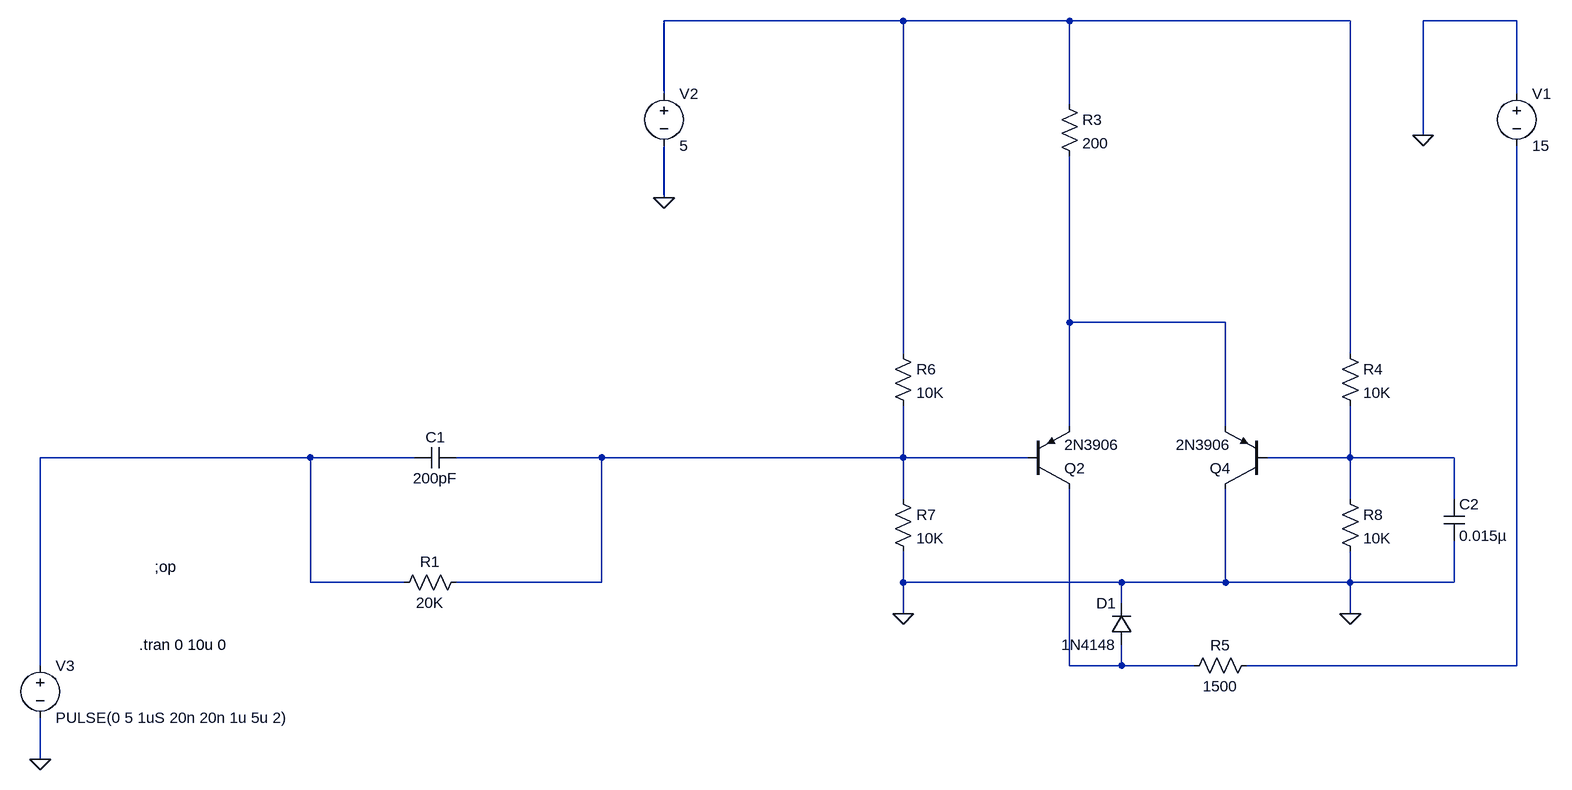
[diagram p0: schematic speed_up1.asc]
speed_up1.asc, the LTspice schematic file:
Version 4
SHEET 1 1588 680
WIRE 464 -848 96 -848
WIRE 720 -848 464 -848
WIRE 1152 -848 720 -848
WIRE 1408 -848 1264 -848
WIRE 96 -736 96 -848
WIRE 1408 -736 1408 -848
WIRE 720 -720 720 -848
WIRE 1264 -672 1264 -848
WIRE 96 -576 96 -656
WIRE 720 -384 720 -640
WIRE 960 -384 720 -384
WIRE 464 -336 464 -848
WIRE 1152 -336 1152 -848
WIRE 720 -224 720 -384
WIRE 960 -224 960 -384
WIRE -448 -176 -864 -176
WIRE -288 -176 -448 -176
WIRE 0 -176 -224 -176
WIRE 464 -176 464 -256
WIRE 464 -176 0 -176
WIRE 656 -176 464 -176
WIRE 1152 -176 1152 -256
WIRE 1152 -176 1024 -176
WIRE 1312 -176 1152 -176
WIRE 464 -112 464 -176
WIRE 1152 -112 1152 -176
WIRE 1312 -112 1312 -176
WIRE -448 16 -448 -176
WIRE -304 16 -448 16
WIRE 0 16 0 -176
WIRE 0 16 -224 16
WIRE 464 16 464 -32
WIRE 800 16 464 16
WIRE 960 16 960 -128
WIRE 960 16 800 16
WIRE 1152 16 1152 -32
WIRE 1152 16 960 16
WIRE 1312 16 1312 -48
WIRE 1312 16 1152 16
WIRE 800 48 800 16
WIRE 464 64 464 16
WIRE 1152 64 1152 16
WIRE -864 144 -864 -176
WIRE 720 144 720 -128
WIRE 800 144 800 112
WIRE 800 144 720 144
WIRE 912 144 800 144
WIRE 1408 144 1408 -656
WIRE 1408 144 992 144
WIRE -864 288 -864 224
FLAG 96 -576 0
FLAG -864 288 0
FLAG 1152 64 0
FLAG 1264 -672 0
FLAG 464 64 0
DATAFLAG 464 -176 ""
DATAFLAG 832 -384 ""
DATAFLAG 1152 -176 ""
SYMBOL cap -224 -192 R90
WINDOW 0 0 32 VBottom 2
WINDOW 3 32 32 VTop 2
SYMATTR InstName C1
SYMATTR Value 200pF
SYMBOL voltage 96 -752 R0
WINDOW 123 0 0 Left 2
WINDOW 39 0 0 Left 2
SYMATTR InstName V2
SYMATTR Value 5
SYMBOL pnp 656 -128 M180
SYMATTR InstName Q2
SYMATTR Value 2N3906
SYMBOL voltage 1408 -752 R0
WINDOW 123 0 0 Left 2
WINDOW 39 0 0 Left 2
SYMATTR InstName V1
SYMATTR Value 15
SYMBOL voltage -864 128 R0
WINDOW 123 0 0 Left 2
WINDOW 39 0 0 Left 2
SYMATTR InstName V3
SYMATTR Value PULSE(0 5 1uS 20n 20n 1u 5u 2)
SYMBOL pnp 1024 -128 R180
SYMATTR InstName Q4
SYMATTR Value 2N3906
SYMBOL res 704 -736 R0
SYMATTR InstName R3
SYMATTR Value 200
SYMBOL res 1136 -352 R0
SYMATTR InstName R4
SYMATTR Value 10K
SYMBOL res 1136 -128 R0
SYMATTR InstName R8
SYMATTR Value 10K
SYMBOL res -208 0 R90
WINDOW 0 0 56 VBottom 2
WINDOW 3 32 56 VTop 2
SYMATTR InstName R1
SYMATTR Value 20K
SYMBOL res 1008 128 R90
WINDOW 0 0 56 VBottom 2
WINDOW 3 32 56 VTop 2
SYMATTR InstName R5
SYMATTR Value 1500
SYMBOL res 448 -352 R0
SYMATTR InstName R6
SYMATTR Value 10K
SYMBOL res 448 -128 R0
SYMATTR InstName R7
SYMATTR Value 10K
SYMBOL cap 1296 -112 R0
SYMATTR InstName C2
SYMATTR Value 0.015µ
SYMATTR SpiceLine V=50 Irms=393m Rser=0.257867 Lser=0 mfg="KEMET" pn="C0805F153K5RAC" type="X7R"
SYMBOL diode 816 112 R180
WINDOW 0 24 64 Left 2
WINDOW 3 24 0 Left 2
SYMATTR InstName D1
SYMATTR Value 1N4148
TEXT -688 -8 Left 2 !;op
TEXT -712 112 Left 2 !.tran 0 10u 0

The netlist it stands for:
* speed_up1.asc
C1 N004 N003 200pF
V2 N001 0 5
Q2 N006 N004 N002 0 2N3906
V1 0 N007 15
V3 N003 0 PULSE(0 5 1uS 20n 20n 1u 5u 2)
Q4 0 N005 N002 0 2N3906
R3 N001 N002 200
R4 N001 N005 10K
R8 N005 0 10K
R1 N004 N003 20K
R5 N007 N006 1500
R6 N001 N004 10K
R7 N004 0 10K
C2 N005 0 0.015µ V=50 Irms=393m Rser=0.257867 Lser=0 mfg="KEMET" pn="C0805F153K5RAC" type="X7R"
D1 N006 0 1N4148
.model D D
.lib standard.dio
.model NPN NPN
.model PNP PNP
.lib standard.bjt
;op
.tran 0 10u 0
.backanno
.end